# Altium schematic sheet TRANSMITTER.SchDoc
size A3
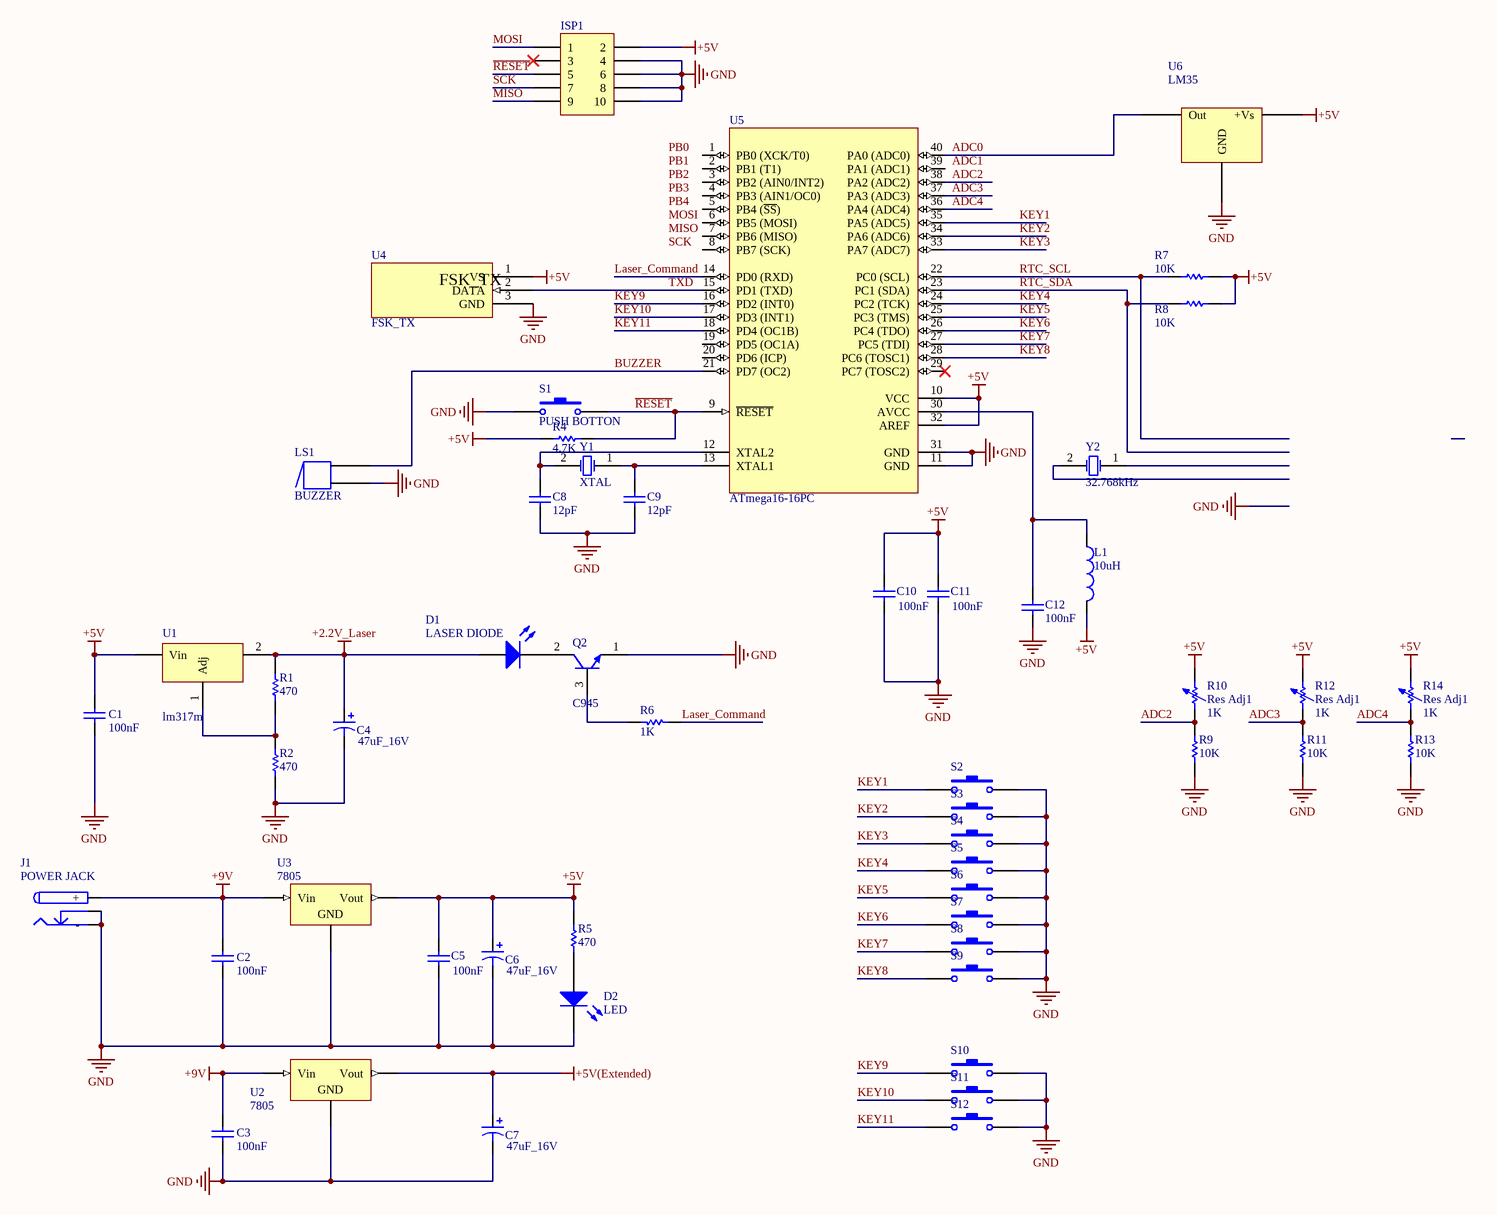
[diagram p0: TRANSMITTER.SchDoc]

## Parts
C1  100nF  [BCY-W2/D3.1]
C2  100nF  [BCY-W2/D3.1]
C3  100nF  [BCY-W2/D3.1]
C4  value 47uF_16V  [cap_pol]  (hidden comment: CAP_POL)
C5  100nF  [BCY-W2/D3.1]
C6  value 47uF_16V  [cap_pol]  (hidden comment: CAP_POL)
C7  value 47uF_16V  [cap_pol]  (hidden comment: CAP_POL)
C8  12pF  [BCY-W2/D3.1]
C9  12pF  [BCY-W2/D3.1]
C10  100nF  [BCY-W2/D3.1]
C11  100nF  [BCY-W2/D3.1]
C12  100nF  [BCY-W2/D3.1]
D1  LASER DIODE  [Com_2pin]
D2  LED  [LED_3mm]
ISP1  ISP Programmer  [IDC2*5]  (value not drawn)
J1  POWER JACK  [term2]
L1  value 10uH  [AXIAL0.3]  (hidden comment: Inductor)
LS1  BUZZER  [buzzer]
Q2  C945  [C945]
R1  470  [AXIAL0.4]
R2  470  [AXIAL0.4]
R4  4.7K  [AXIAL0.4]
R5  470  [AXIAL0.4]
R6  1K  [AXIAL0.4]
R7  10K  [AXIAL0.4]
R8  10K  [AXIAL0.4]
R9  10K  [AXIAL0.4]
R10  Res Adj1  value 1K  [Com_2pin]
R11  10K  [AXIAL0.4]
R12  Res Adj1  value 1K  [Com_2pin]
R13  10K  [AXIAL0.4]
R14  Res Adj1  value 1K  [Com_2pin]
S1  PUSH BOTTON  [PUSH BUTTON]
S2  PUSH BOTTON  [PUSH BUTTON]  (value not drawn)
S3  PUSH BOTTON  [PUSH BUTTON]  (value not drawn)
S4  PUSH BOTTON  [PUSH BUTTON]  (value not drawn)
S5  PUSH BOTTON  [PUSH BUTTON]  (value not drawn)
S6  PUSH BOTTON  [PUSH BUTTON]  (value not drawn)
S7  PUSH BOTTON  [PUSH BUTTON]  (value not drawn)
S8  PUSH BOTTON  [PUSH BUTTON]  (value not drawn)
S9  PUSH BOTTON  [PUSH BUTTON]  (value not drawn)
S10  PUSH BOTTON  [PUSH BUTTON]  (value not drawn)
S11  PUSH BOTTON  [PUSH BUTTON]  (value not drawn)
S12  PUSH BOTTON  [PUSH BUTTON]  (value not drawn)
U1  lm317m  [17D]
U2  7805  [7805]
U3  7805  [7805]
U4  FSK_TX  [FSK_TX]
U5  ATmega16-16PC  [40P6]
U6  LM35  [C945]
Y1  XTAL  [XTAL]
Y2  32.768kHz  [R145]

## Nets
+2.2V_Laser: C4.1 D1.1(A) R1.1 U1.2(Vout)
+5V: C1.2 C5.2 C6.1 C10.2 C11.2 ISP1.2 L1.2 R4.2 R5.1 R7.2 R8.1 R10.2 R12.2 R14.2 U1.3(Vin) U3.3(Vout) U4.1(VS) U5.10(VCC) U5.32(AREF) U6.1(+Vs)
+5V(Extended): C7.1 U2.3(Vout)
+9V: C2.2 C3.2 J1.1(+) U2.1(Vin) U3.1(Vin)
GND: C1.1 C2.1 C3.1 C4.2 C5.1 C6.2 C7.2 C8.1 C9.1 C10.1 C11.1 C12.1 D2.2(K) ISP1.4 ISP1.6 ISP1.8 ISP1.10 J1.2(-) LS1.2 Q2.1(E) R2.2 R9.1 R11.1 R13.1 S1.1 S2.2 S3.2 S4.2 S5.2 S6.2 S7.2 S8.2 S9.2 S10.2 S11.2 S12.2 U2.2(GND) U3.2(GND) U4.3(GND) U5.11(GND) U5.31(GND) U6.3(GND)
ADC0: U5.40(PA0_(ADC0)) U6.2(Out)
ADC2: R9.2 R10.1 U5.38(PA2_(ADC2))
ADC3: R11.2 R12.1 U5.37(PA3_(ADC3))
ADC4: R13.2 R14.1 U5.36(PA4_(ADC4))
BUZZER: LS1.1 U5.21(PD7_(OC2))
KEY1: S2.1 U5.35(PA5_(ADC5))
KEY2: S3.1 U5.34(PA6_(ADC6))
KEY3: S4.1 U5.33(PA7_(ADC7))
KEY4: S5.1 U5.24(PC2_(TCK))
KEY5: S6.1 U5.25(PC3_(TMS))
KEY6: S7.1 U5.26(PC4_(TDO))
KEY7: S8.1 U5.27(PC5_(TDI))
KEY8: S9.1 U5.28(PC6_(TOSC1))
KEY9: S10.1 U5.16(PD2_(INT0))
KEY10: S11.1 U5.17(PD3_(INT1))
KEY11: S12.1 U5.18(PD4_(OC1B))
Laser_Command: R6.1 U5.14(PD0_(RXD))
MISO: ISP1.9
MOSI: ISP1.1
~{RESET}: ISP1.5 R4.1 S1.2 U5.9(~{RESET})
RTC_SCL: R7.1 U5.22(PC0_(SCL))
RTC_SDA: R8.2 U5.23(PC1_(SDA))
SCK: ISP1.7
TXD: U4.2(DATA) U5.15(PD1_(TXD))
NetC8_2: C8.2 U5.12(XTAL2) Y1.2(OSC2)
NetC9_2: C9.2 U5.13(XTAL1) Y1.1(OSC1)
NetC12_2: C12.2 L1.1 U5.30(AVCC)
NetD1_2: D1.2(K) Q2.2(C)
NetD2_1: D2.1(A) R5.2
NetQ2_3: Q2.3(B) R6.2
NetR1_2: R1.2 R2.1 U1.1(Adj)

Not connected (* = marked no-connect by the designer): ISP1 3*; U5 1(PB0_(XCK/T0)) 2(PB1_(T1)) 3(PB2_(AIN0/INT2)) 4(PB3_(AIN1/OC0)) 5(PB4_(~{SS})) 6(PB5_(MOSI)) 7(PB6_(MISO)) 8(PB7_(SCK)) 19(PD5_(OC1A)) 20(PD6_(ICP)) 29(PC7_(TOSC2))* 39(PA1_(ADC1)); Y2 1(OSC1) 2(OSC2)

## Notes on the sheet
- LCD 4X19
- LCD 4X20
- LCD 4X21
- LCD 4X22
- LCD 4X23
- Labels drawn without touching a wire or pin: ADC1, MISO, MOSI, PB0, PB1, PB2, PB3, PB4, SCK

## Library data of the parts
C1-C3 C5 C8-C11 = CAP
  C1-C3 C5 C10 C11: Value: 100nF
  C8 C9: Value: 12pF
C12 = Cap Semi: Capacitor (Semiconductor SIM Model); Published: 8-Jun-2000; LatestRevisionDate: 17-Jul-2002; LatestRevisionNote: Re-released for DXP Platform.; PackageReference: C1206; Publisher: Altium Limited; Value: 100nF
D1 = LED: Value: *
ISP1 = Header 5X2: Header, 5-Pin, Dual row; LatestRevisionDate: 17-Jul-2002; LatestRevisionNote: Re-released for DXP Platform.; Publisher: Altium Limited
LS1 = BUZZER: Magnetic Transducer Buzzer; Value: *
Q2 = C945: NPN Bipolar Junction Transistor; Value: *
R1 R2 R4-R9 R11 R13 = RES
  R1 R2 R5: Value: 470
  R4: Value: 4.7K
  R6: Value: 1K
  R7-R9 R11 R13: Value: 10K
R10 R12 R14 = Res Adj1: Variable Resistor; Set Position: 0.5; Published: 8-Jun-2000; LatestRevisionDate: 17-Jul-2002; LatestRevisionNote: Re-released for DXP Platform.; PackageReference: AXIAL-0.7; Publisher: Altium Limited
U5 = ATmega16-16PC: 8-Bit AVR Microcontroller with 16K Bytes of In-System Programmable Flash Memory; Published: 17-Sep-2003; LatestRevisionDate: 4-Mar-2005; LatestRevisionNote: Stylized 3D Model Added.; DatasheetDocument: 2466E-AVR-10/02; PackageDocument: Dec-1999; PackageReference: 40P6; Publisher: Altium Limited; ComponentLink1Description: Manufacturer Link; ComponentLink1URL: http://www.atmel.com; ComponentLink2Description: Datasheet; ComponentLink2URL: http://www.atmel.com/dyn/resources/prod_documents/doc2466.pdf
Y1 Y2 = XTAL: Crystal Oscillator; Published: 8-Jun-2000; Revision: July-2002: Re-released for DXP Platform.; Publisher: Altium Limited
D2 = LED: Value: *
J1 = POWER JACK: Value: *
L1 = Inductor: Published: 8-Jun-2000; Revision: July-2002: Re-released for DXP Platform.; Publisher: Altium Limited
S1-S12 = PUSH BOTTON: Value: *
U2 U3 = 7805: Value: *